# Altium schematic sheet [F_V1]MCU_Sheet.SchDoc
size A2; SheetNumber: 3; SheetTotal: 5
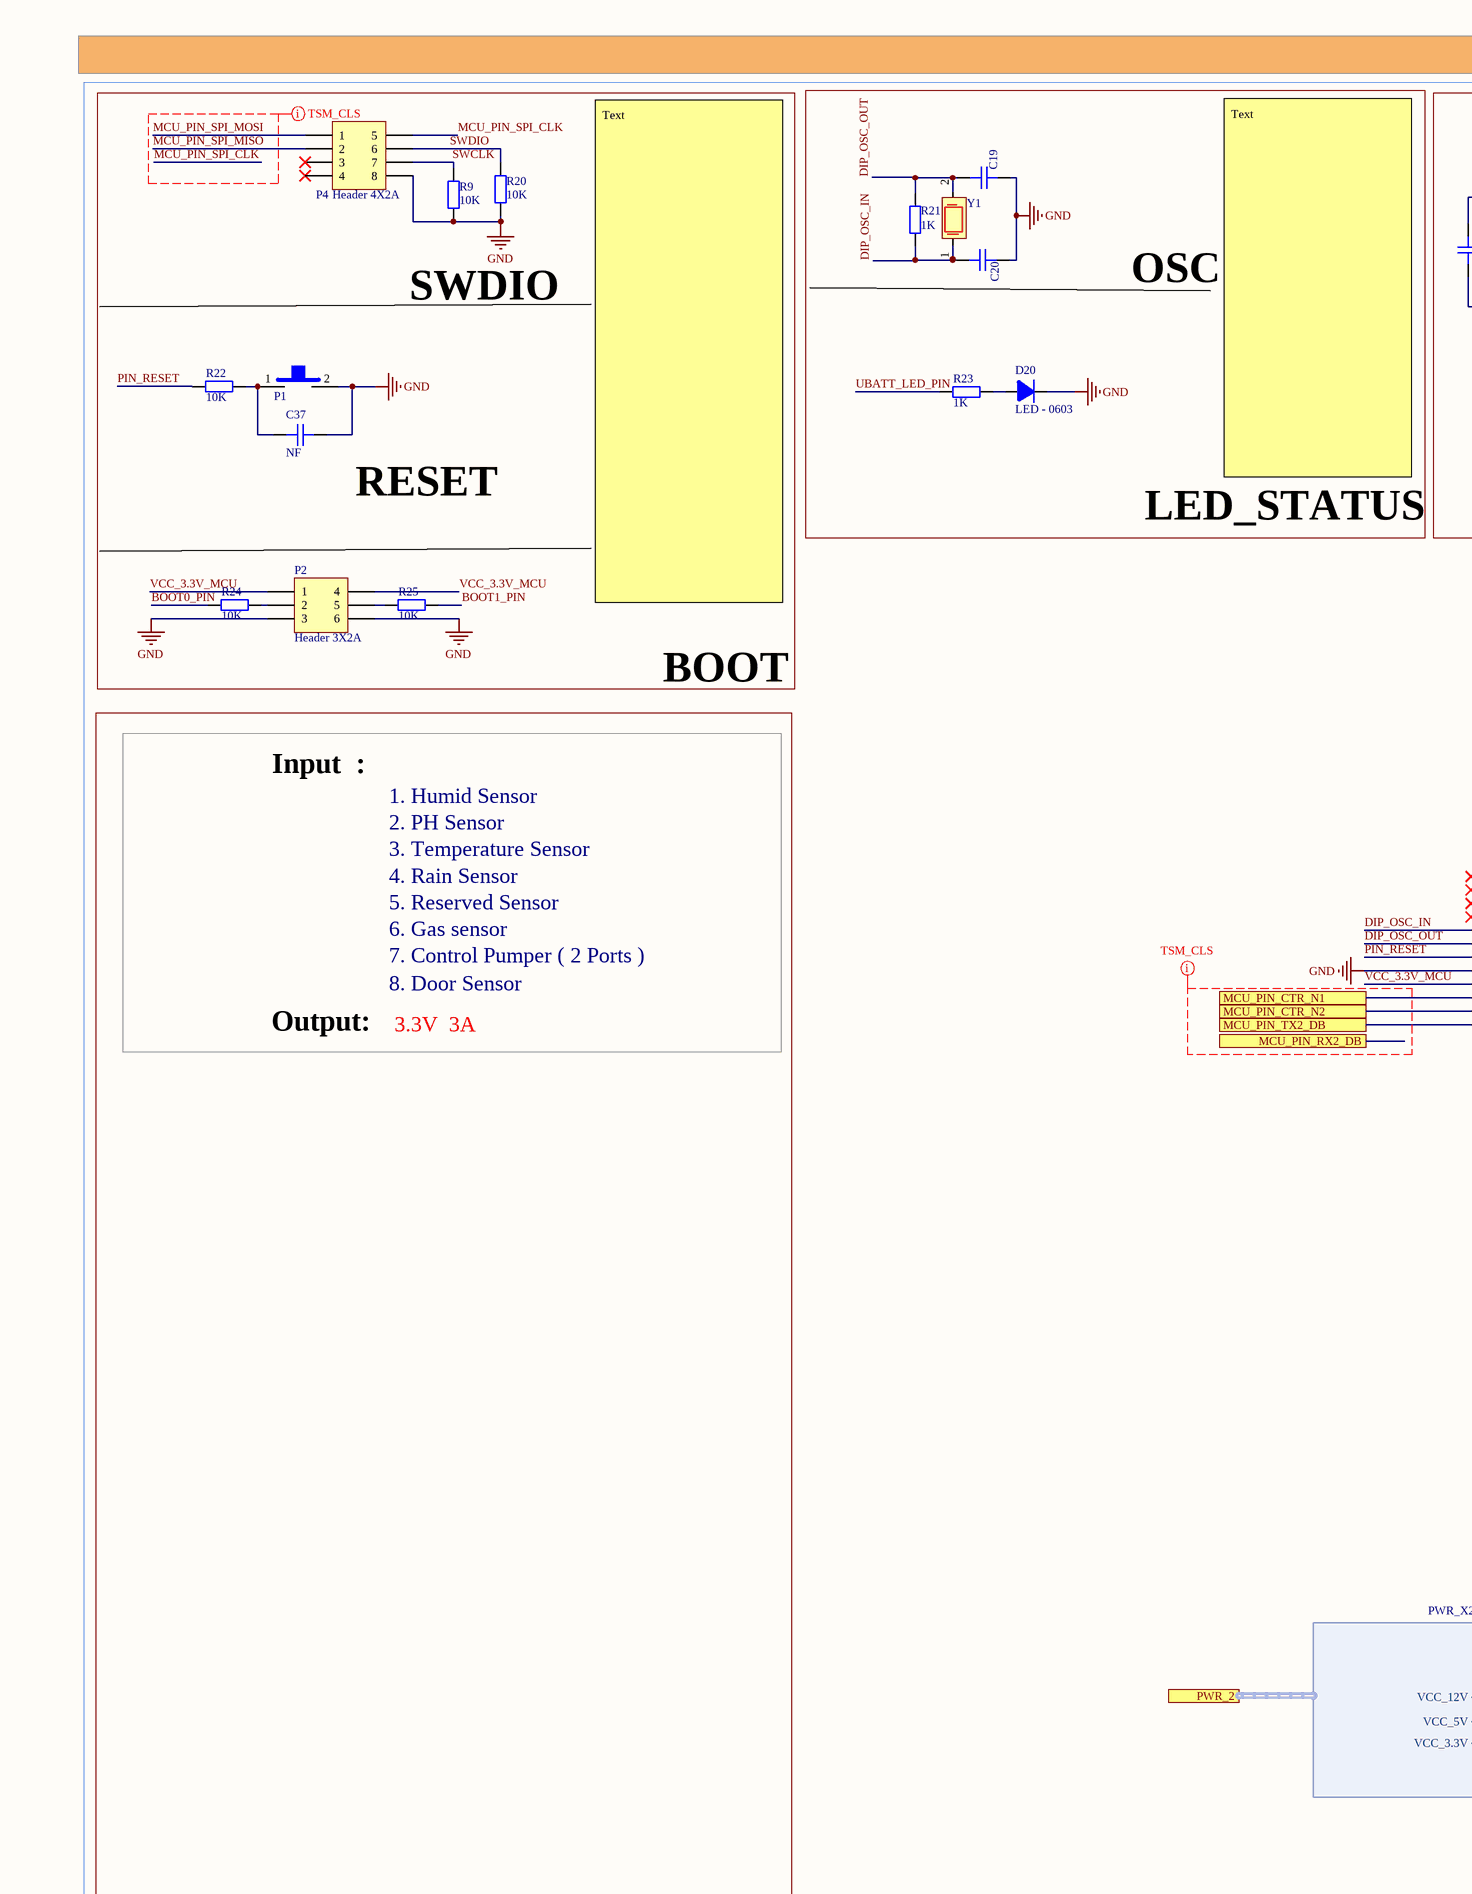
[diagram p0: [F_V1]MCU_Sheet.SchDoc, left]
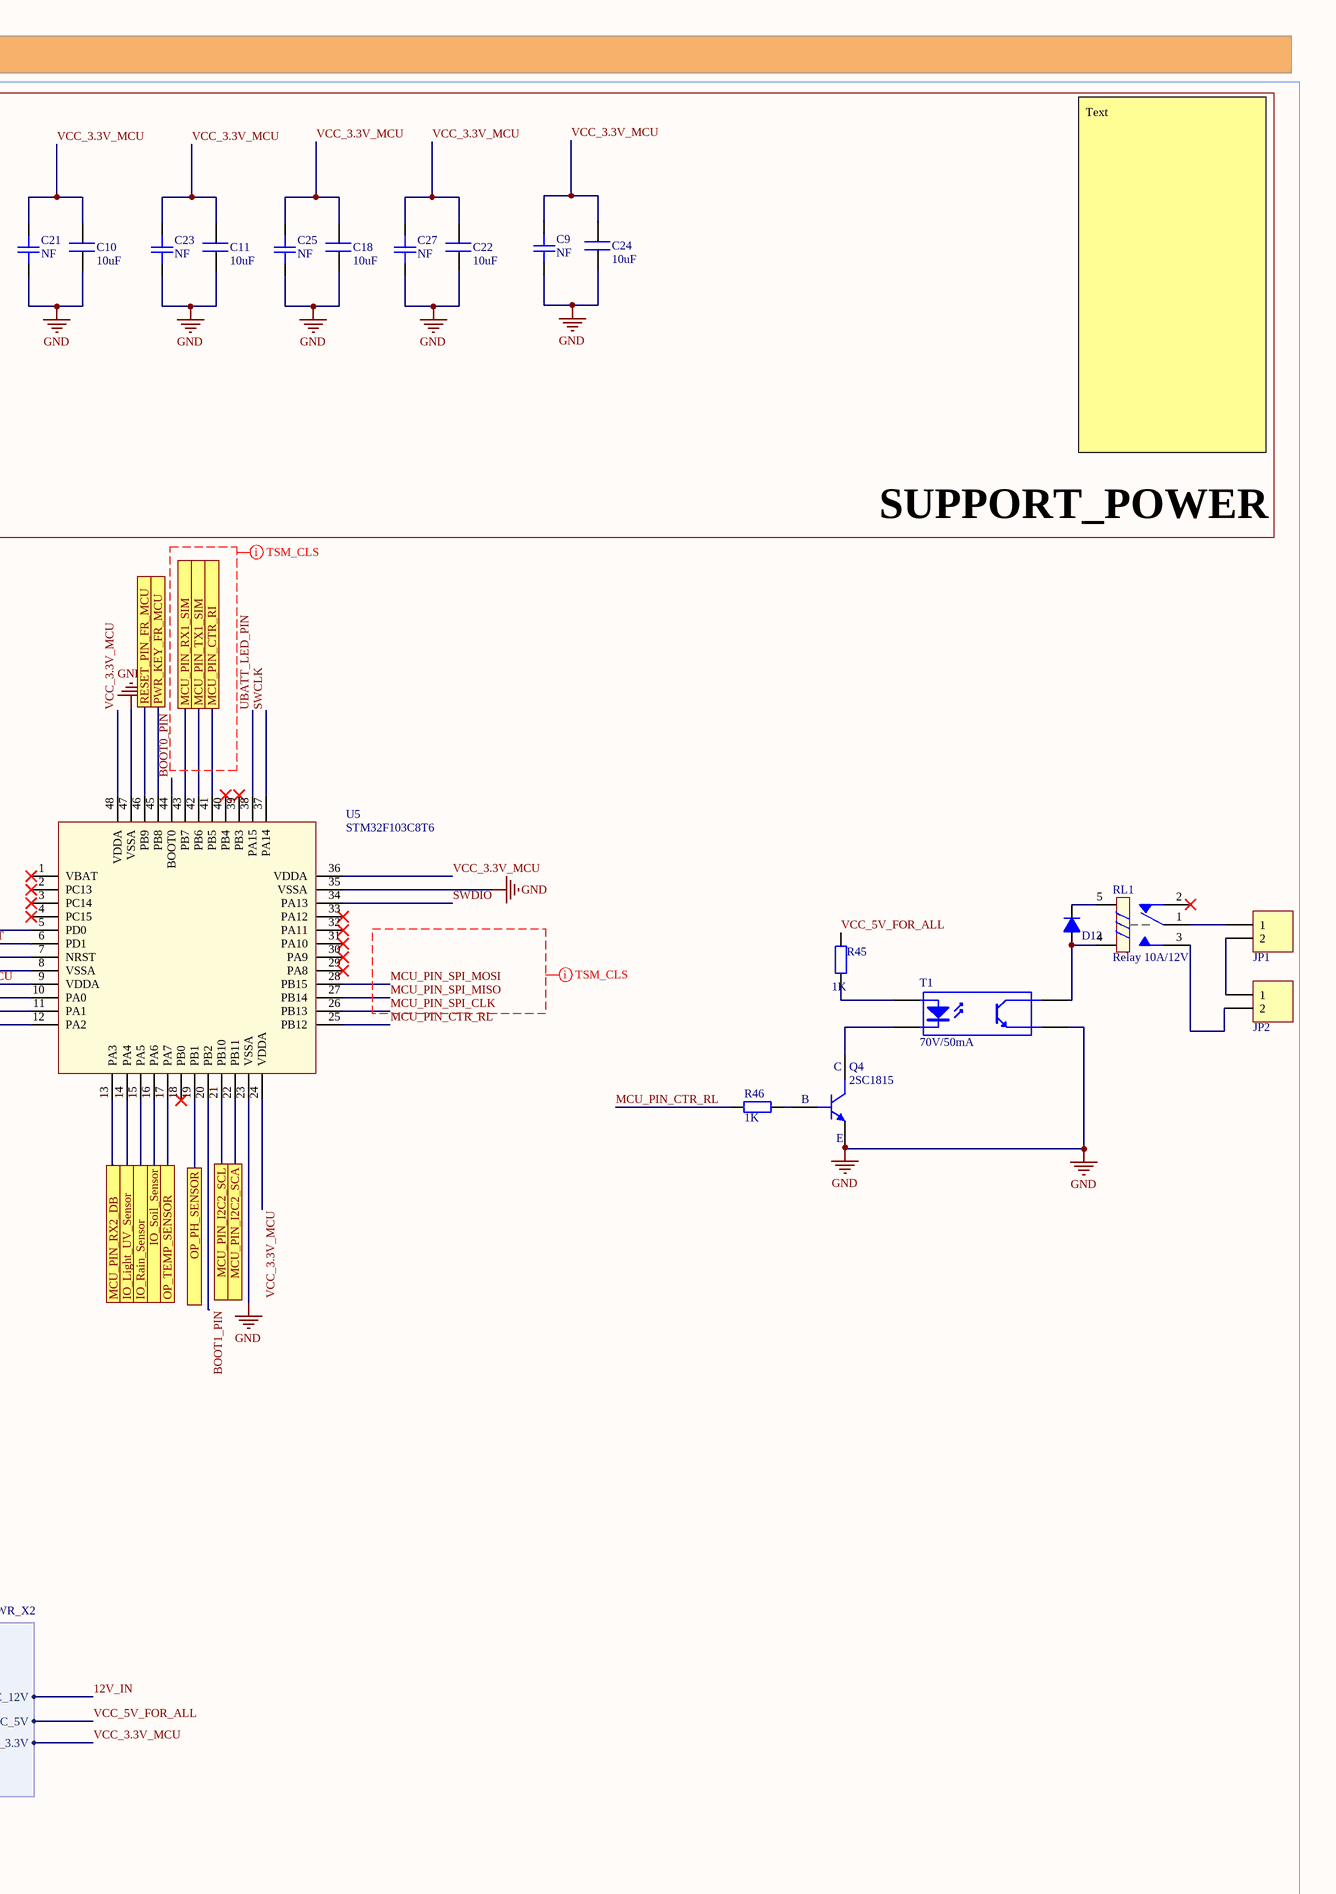
[diagram p1: [F_V1]MCU_Sheet.SchDoc, right]

## Parts
C9  NF  [CAPC-0603 (1608)]
C10  10uF  [CAP 10uF SMD 0805]
C11  10uF  [CAP 10uF SMD 0805]
C18  10uF  [CAP 10uF SMD 0805]
C19  NF  [CAPC-0603 (1608)]  (value not drawn)
C20  NF  [CAPC-0603 (1608)]  (value not drawn)
C21  NF  [CAPC-0603 (1608)]
C22  10uF  [CAP 10uF SMD 0805]
C23  NF  [CAPC-0603 (1608)]
C24  10uF  [CAP 10uF SMD 0805]
C25  NF  [CAPC-0603 (1608)]
C27  NF  [CAPC-0603 (1608)]
C37  NF  [CAPC-0603 (1608)]
D12  Diode  1N4007  [DO-214AC]  (value not drawn)
D20  LED - 0603  [LED - 0603]
JP1  Header 2_1  [HED2]  (value not drawn)
JP2  Header 2_1  [HED2]  (value not drawn)
P1  (no value)  [SW 2P SMD]
P2  Header 3X2A  [HDR2X3_CEN]
P4  Header 4X2A  [HDR2X4_CEN]
Q4  2SC1815  [SOT23_3]
R9  10K  [RESC-0603 (1608)]
R20  10K  [RESC-0603 (1608)]
R21  1K  [RESC-0603 (1608)]
R22  10K  [RESC-0603 (1608)]
R23  1K  [RESC-0603 (1608)]
R24  10K  [RESC-0603 (1608)]
R25  10K  [RESC-0603 (1608)]
R45  1K  [RESC-0603 (1608)]
R46  1K  [RESC-0603 (1608)]
RL1  Relay 10A/12V  [RL_SPDT_10A]
T1  70V/50mA  [OPTO TRANSISTOR_SMD-4]
U5  STM32F103C8T6  [STM32F103C8T6]
Y1  CRYSTAL - 8MHZ  [CRYSTAL - 8Mhz]  (value not drawn)

## Blocks framed on the sheet
SUPPORT_POWER: C9-C11 C18 C21-C25 C27

## Ports
IO_Light_UV_Sensor, IO_Rain_Sensor, IO_Soil_Sensor, MCU_PIN_CTR_N1, MCU_PIN_CTR_N2, MCU_PIN_CTR_RI, MCU_PIN_I2C2_SCA, MCU_PIN_I2C2_SCL, MCU_PIN_RX1_SIM, MCU_PIN_RX2_DB, MCU_PIN_TX1_SIM, MCU_PIN_TX2_DB, OP_PH_SENSOR, OP_TEMP_SENSOR, PWR_2 (harness PWR_X2), PWR_KEY_FR_MCU, RESET_PIN_FR_MCU

## Harnesses
PWR_X2: VCC_12V, VCC_5V, VCC_3.3V

## Nets
GND: C9.1 C10.1 C11.1 C18.1 C19.1 C20.1 C21.1 C22.1 C23.1 C24.1 C25.1 C27.1 C37.1 D20.2(K) P1.2 P2.3 P2.6 P4.8 Q4.2(E) R9.2 R20.2 T1.3 U5.8(VSSA) U5.23(VSSA) U5.35(VSSA) U5.47(VSSA)
12V_IN: port PWR_2.VCC_12V
BOOT0_PIN: R24.1 U5.44(BOOT0)
BOOT1_PIN: R25.2 U5.20(PB2)
DIP_OSC_IN: C20.2 R21.2 U5.5(PD0) Y1.1
DIP_OSC_OUT: C19.2 R21.1 U5.6(PD1) Y1.2
IO_Light_UV_Sensor: U5.14(PA4) ; port IO_Light_UV_Sensor
IO_Rain_Sensor: U5.15(PA5) ; port IO_Rain_Sensor
IO_Soil_Sensor: U5.16(PA6) ; port IO_Soil_Sensor
MCU_PIN_CTR_N1: U5.10(PA0) ; port MCU_PIN_CTR_N1
MCU_PIN_CTR_N2: U5.11(PA1) ; port MCU_PIN_CTR_N2
MCU_PIN_CTR_RI: U5.41(PB5) ; port MCU_PIN_CTR_RI
MCU_PIN_CTR_RL: R46.1 U5.25(PB12)
MCU_PIN_I2C2_SCA: U5.22(PB11) ; port MCU_PIN_I2C2_SCA
MCU_PIN_I2C2_SCL: U5.21(PB10) ; port MCU_PIN_I2C2_SCL
MCU_PIN_RX1_SIM: U5.43(PB7) ; port MCU_PIN_RX1_SIM
MCU_PIN_RX2_DB: U5.13(PA3) ; port MCU_PIN_RX2_DB
MCU_PIN_SPI_CLK: P4.5 U5.26(PB13)
MCU_PIN_SPI_MISO: P4.2 U5.27(PB14)
MCU_PIN_SPI_MOSI: P4.1 U5.28(PB15)
MCU_PIN_TX1_SIM: U5.42(PB6) ; port MCU_PIN_TX1_SIM
MCU_PIN_TX2_DB: U5.12(PA2) ; port MCU_PIN_TX2_DB
OP_PH_SENSOR: U5.19(PB1) ; port OP_PH_SENSOR
OP_TEMP_SENSOR: U5.17(PA7) ; port OP_TEMP_SENSOR
PIN_RESET: R22.1 U5.7(NRST)
PWR_KEY_FR_MCU: U5.45(PB8) ; port PWR_KEY_FR_MCU
RESET_PIN_FR_MCU: U5.46(PB9) ; port RESET_PIN_FR_MCU
SWCLK: P4.7 R9.1 U5.37(PA14)
SWDIO: P4.6 R20.1 U5.34(PA13)
UBATT_LED_PIN: R23.1 U5.38(PA15)
VCC_3.3V_MCU: C9.2 C10.2 C11.2 C18.2 C21.2 C22.2 C23.2 C24.2 C25.2 C27.2 P2.1 P2.4 U5.9(VDDA) U5.24(VDDA) U5.36(VDDA) U5.48(VDDA) ; port PWR_2.VCC_3.3V
VCC_5V_FOR_ALL: R45.1 ; port PWR_2.VCC_5V
NetC37_2: C37.2 P1.1 R22.2
NetD12_A: D12.A RL1.4 T1.4
NetD12_K: D12.K RL1.5
NetD20_1: D20.1(A) R23.2
NetJP1_1: JP1.1 RL1.1
NetJP1_2: JP1.2 JP2.1
NetJP2_2: JP2.2 RL1.3
NetP2_2: P2.2 R24.2
NetP2_5: P2.5 R25.1
NetQ4_1: Q4.1(B) R46.2
NetQ4_3: Q4.3(C) T1.2
NetR45_2: R45.2 T1.1

Not connected (* = marked no-connect by the designer): P4 3* 4*; RL1 2*; U5 1(VBAT)* 2(PC13)* 3(PC14)* 4(PC15)* 18(PB0)* 29(PA8)* 30(PA9)* 31(PA10)* 32(PA11)* 33(PA12)* 39(PB3)* 40(PB4)*

## Layout directives
net class TSM_CLS: (no net found under the mark), MCU_PIN_SPI_CLK, MCU_PIN_SPI_MISO, MCU_PIN_SPI_MOSI

## Notes on the sheet
- OSC
- SWDIO
- Text
- (near C37) RESET
- LED_STATUS
- BOOT
- Input  :
- 1. Humid Sensor
- 2. PH Sensor
- 3. Temperature Sensor
- 4. Rain Sensor
- 5. Reserved Sensor
- 6. Gas sensor
- 7. Control Pumper ( 2 Ports )
- Output:
- 8. Door Sensor
- 3.3V  3A

## Library data of the parts
C9 C19-C21 C23 C25 C27 C37 = CAPC NF 0603: CAP SMD, Not Fill, 0603; Solder: Not Fill; Value: NF; Category: CAPACITOR
C10 C11 C18 C22 C24 = CAP 0805 10uF SMD
D12 = Diode  1N4007: Diode 1A; Value: 1N4007
JP1 JP2 = Header 2_1: Header, 2-Pin; Manufacturer: Generic Components; Class: Connector; Value: Header 2
P1 = Button 2 SMD: SMD Mini Push Button Switch 2 Pin 3x6x2.7mm; MPN: SMD Mini Push Button 2 SMD; Link: https://ram-e-shop.com/product/press2pin-smd/
P2 = Header 3X2A: Header, 3-Pin, Dual row; LatestRevisionDate: 17-Jul-2002; LatestRevisionNote: Re-released for DXP Platform.; Publisher: Altium Limited
P4 = Header 4X2A: Header, 4-Pin, Dual row; Solder: WAVE
Q4 = 2SC1815: TRANS NPN 50V 0.15A SOT23-3; Solder: SMT; MPN: 2SC1815; Value: 2SC1815
R9 R20-R25 R45 R46 = CRCW06035R10FKEA: RES SMD 5.1 OHM 1% 1/10W 0603; MFR: Vishay Dale; Value: 5.1R; Solder: SMT; MPN: CRCW06035R10FKEA; Category: RESISTOR; PinCount: 2
RL1 = Relay 1: Relay SPDT,10A - 12VDC 5 Pin; Value: Relay SPDT, 10A, 12V
T1 = HCPL-817-500E: OPTOISOLATOR 5KV TRANSISTOR 4SMD; Solder: SMT; CompanyID: VT-00147; Value: 70V/50mA; MPN: HCPL-817-500E